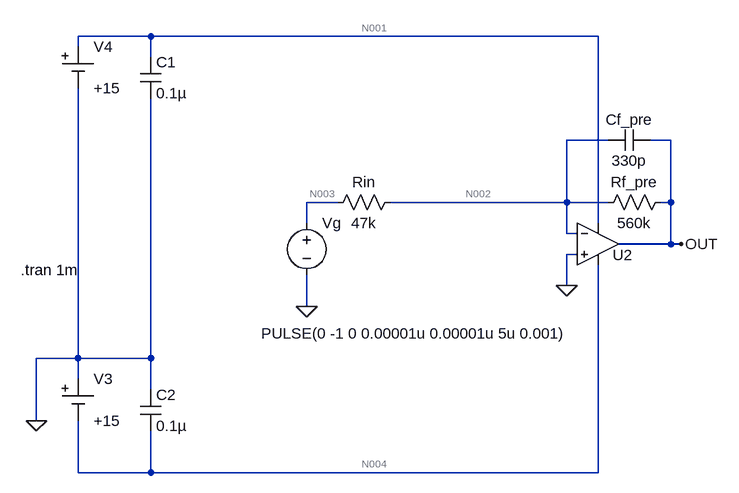
[diagram p0: schematic circuito_1_1.asc]
circuito_1_1.asc, the LTspice schematic file:
Version 4
SHEET 1 880 680
WIRE -160 -16 -272 -16
WIRE 528 -16 -160 -16
WIRE -272 0 -272 -16
WIRE -160 16 -160 -16
WIRE 544 144 480 144
WIRE 640 144 608 144
WIRE 128 240 80 240
WIRE 480 240 480 144
WIRE 480 240 208 240
WIRE 544 240 480 240
WIRE 640 240 640 144
WIRE 640 240 624 240
WIRE 80 272 80 240
WIRE 528 272 528 -16
WIRE 480 288 480 240
WIRE 496 288 480 288
WIRE 640 304 640 240
WIRE 640 304 560 304
WIRE 656 304 640 304
WIRE 496 320 480 320
WIRE 480 368 480 320
WIRE 80 400 80 352
WIRE -272 480 -272 64
WIRE -272 480 -336 480
WIRE -160 480 -160 80
WIRE -160 480 -272 480
WIRE -272 512 -272 480
WIRE -160 528 -160 480
WIRE -336 576 -336 480
WIRE -272 656 -272 576
WIRE -160 656 -160 592
WIRE -160 656 -272 656
WIRE 528 656 528 336
WIRE 528 656 -160 656
FLAG -336 576 0
FLAG 656 304 OUT
FLAG 80 400 0
FLAG 480 368 0
SYMBOL cap -176 528 R0
SYMATTR InstName C2
SYMATTR Value 0.1µ
SYMBOL Misc\\cell -272 512 R0
WINDOW 123 0 0 Left 0
WINDOW 39 0 0 Left 0
SYMATTR InstName V3
SYMATTR Value +15
SYMBOL Misc\\cell -272 0 R0
WINDOW 123 0 0 Left 0
WINDOW 39 0 0 Left 0
SYMATTR InstName V4
SYMATTR Value +15
SYMBOL res 640 224 R90
WINDOW 0 0 56 VBottom 2
WINDOW 3 32 56 VTop 2
SYMATTR InstName Rf_pre
SYMATTR Value 560k
SYMBOL cap -176 16 R0
SYMATTR InstName C1
SYMATTR Value 0.1µ
SYMBOL Opamps/UniversalOpamp2 528 304 R0
WINDOW 0 23 17 Left 2
SYMATTR InstName U2
SYMBOL voltage 80 256 R0
WINDOW 3 -70 186 Left 2
WINDOW 123 0 0 Left 0
WINDOW 39 0 0 Left 0
SYMATTR Value PULSE(0 -1 0 0.00001u 0.00001u 5u 0.001)
SYMATTR InstName Vg
SYMBOL res 224 224 R90
WINDOW 0 0 56 VBottom 2
WINDOW 3 32 56 VTop 2
SYMATTR InstName Rin
SYMATTR Value 47k
SYMBOL cap 608 128 R90
WINDOW 0 0 32 VBottom 2
WINDOW 3 32 32 VTop 2
SYMATTR InstName Cf_pre
SYMATTR Value 330p
TEXT -360 344 Left 2 !.tran 1m

The netlist it stands for:
* circuito_1_1.asc
C2 0 N004 0.1µ
V3 0 N004 +15
V4 N001 0 +15
Rf_pre OUT N002 560k
C1 N001 0 0.1µ
XU2 0 N002 N001 N004 OUT level.2 Avol=1Meg GBW=10Meg Slew=10Meg ilimit=25m rail=0 Vos=0 phimargin=45 en=0 enk=0 in=0 ink=0 Rin=500Meg  ; pins IN+ IN- V+ V- OUT
Vg N003 0 PULSE(0 -1 0 0.00001u 0.00001u 5u 0.001)
Rin N002 N003 47k
Cf_pre OUT N002 330p
.tran 1m
.lib UniversalOpamps2.sub
.backanno
.end

* Results of the author's LTspice run, read from the files saved beside the schematic
* Operating Point, zero values left out:
*   V(n004) = -15 V
*   V(n001) = 15 V
*   I(V4) = -15 µA
*   I(V3) = -15 µA
*   Ix(u2:3) = 15 µA
*   Ix(u2:4) = -15 µA
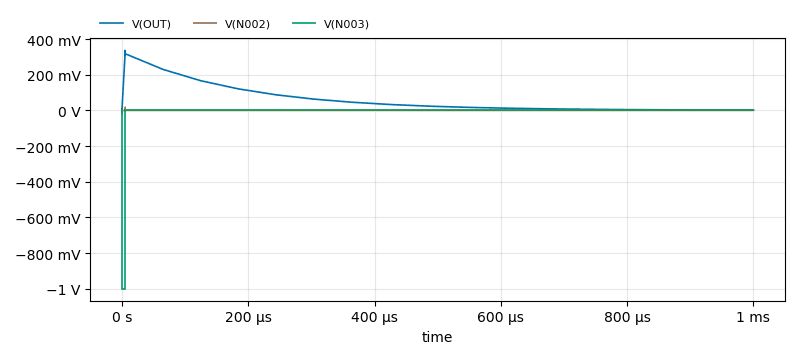
[diagram p1: Transient Analysis of circuito_1_1.asc, plotted from the saved traces]
* Transient Analysis, 1 run:
*   V(OUT): min -18.99 mV, max 336.3 mV, average 59.81 mV, rms 99.19 mV, last 1.466 mV
*   V(N002): min -19.5 mV, max 18.44 mV, average -61.56 nV, rms 151.7 µV, last 124.6 nV
*   V(N003): min -1 V, max 0 V, average -5 mV, rms 70.71 mV, last 0 V